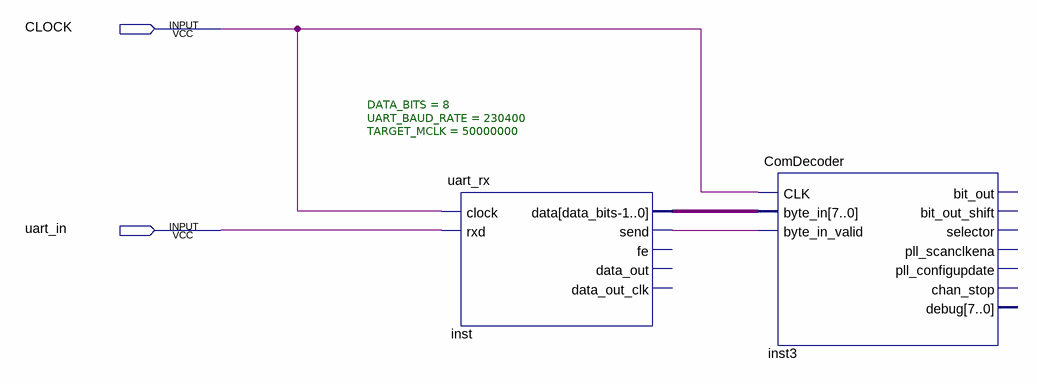
[diagram p0: schematic sheet]
// Quartus schematic comms.bdf as structural Verilog: 2 symbols, 2 pins
module comms (
  input  CLOCK,
  input  uart_in
);

  wire inst_send;
  wire [7:0] inst_data;

  uart_rx #(.DATA_BITS(8), .UART_BAUD_RATE(230400), .TARGET_MCLK(50000000)) inst (
    .clock(CLOCK), .rxd(uart_in), .data(inst_data), .send(inst_send));  // open: fe, data_out, data_out_clk
  ComDecoder inst3 (
    .CLK(CLOCK), .byte_in(inst_data), .byte_in_valid(inst_send));  // open: bit_out, bit_out_shift, selector, pll_scanclkena, pll_configupdate, chan_stop, debug
endmodule
